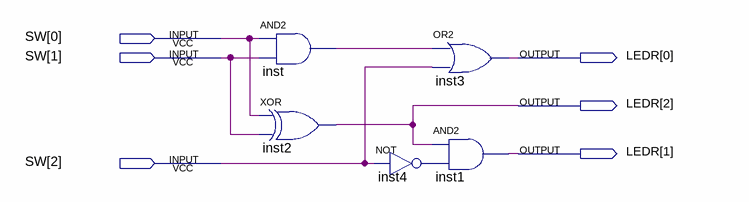
[diagram p0: schematic sheet]
// Quartus schematic diagrama_bloco.bdf as structural Verilog: 5 symbols, 6 pins
module diagrama_bloco (
  input  [2:0] SW,
  output [2:0] LEDR
);

  wire inst4_out, inst_out;

  and inst (inst_out, SW[0], SW[1]);
  xor inst2 (LEDR[2], SW[0], SW[1]);
  not inst4 (inst4_out, SW[2]);
  or inst3 (LEDR[0], inst_out, SW[2]);
  and inst1 (LEDR[1], LEDR[2], inst4_out);
endmodule
